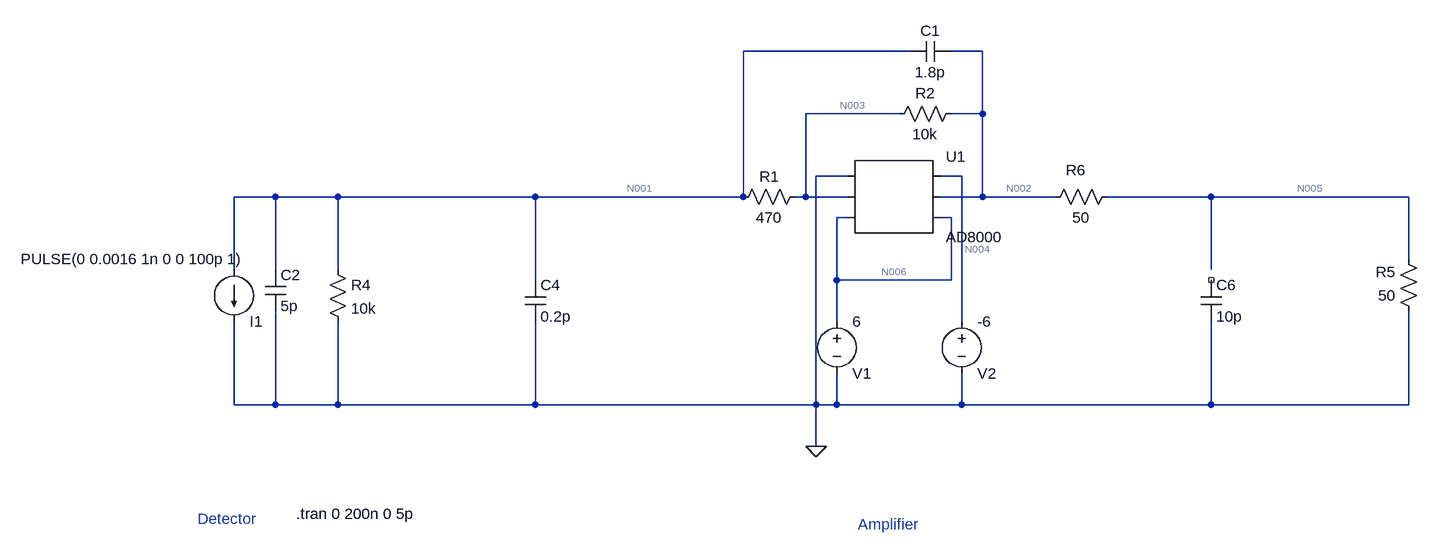
[diagram p0: schematic CFOA-AD8000.asc]
CFOA-AD8000.asc, the LTspice schematic file:
Version 4
SHEET 1 2308 680
WIRE -1488 -2176 -1744 -2176
WIRE -1376 -2176 -1424 -2176
WIRE -1504 -2080 -1648 -2080
WIRE -1376 -2080 -1376 -2176
WIRE -1376 -2080 -1424 -2080
WIRE -1584 -1984 -1632 -1984
WIRE -1408 -1984 -1440 -1984
WIRE -2464 -1952 -2528 -1952
WIRE -2368 -1952 -2464 -1952
WIRE -2064 -1952 -2368 -1952
WIRE -1744 -1952 -1744 -2176
WIRE -1744 -1952 -2064 -1952
WIRE -1648 -1952 -1648 -2080
WIRE -1648 -1952 -1664 -1952
WIRE -1584 -1952 -1648 -1952
WIRE -1376 -1952 -1376 -2080
WIRE -1376 -1952 -1440 -1952
WIRE -1264 -1952 -1376 -1952
WIRE -1024 -1952 -1184 -1952
WIRE -720 -1952 -1024 -1952
WIRE -1584 -1920 -1600 -1920
WIRE -1424 -1920 -1440 -1920
WIRE -720 -1856 -720 -1952
WIRE -2528 -1840 -2528 -1952
WIRE -2464 -1840 -2464 -1952
WIRE -2368 -1840 -2368 -1952
WIRE -1024 -1840 -1024 -1952
WIRE -2064 -1824 -2064 -1952
WIRE -1600 -1824 -1600 -1920
WIRE -1424 -1824 -1424 -1920
WIRE -1424 -1824 -1600 -1824
WIRE -1600 -1760 -1600 -1824
WIRE -1408 -1760 -1408 -1984
WIRE -2528 -1632 -2528 -1760
WIRE -2464 -1632 -2464 -1776
WIRE -2464 -1632 -2528 -1632
WIRE -2368 -1632 -2368 -1760
WIRE -2368 -1632 -2464 -1632
WIRE -2064 -1632 -2064 -1760
WIRE -2064 -1632 -2368 -1632
WIRE -1632 -1632 -1632 -1984
WIRE -1632 -1632 -2064 -1632
WIRE -1600 -1632 -1600 -1680
WIRE -1600 -1632 -1632 -1632
WIRE -1408 -1632 -1408 -1680
WIRE -1408 -1632 -1600 -1632
WIRE -1024 -1632 -1024 -1760
WIRE -1024 -1632 -1408 -1632
WIRE -720 -1632 -720 -1776
WIRE -720 -1632 -1024 -1632
WIRE -1632 -1568 -1632 -1632
FLAG -1632 -1568 0
SYMBOL res -1648 -1968 R90
WINDOW 0 0 56 VBottom 2
WINDOW 3 32 56 VTop 2
SYMATTR InstName R1
SYMATTR Value 470
SYMBOL res -1520 -2064 R270
WINDOW 0 32 56 VTop 2
WINDOW 3 0 56 VBottom 2
SYMATTR InstName R2
SYMATTR Value 10k
SYMBOL cap -1488 -2160 R270
WINDOW 0 32 32 VTop 2
WINDOW 3 0 32 VBottom 2
SYMATTR InstName C1
SYMATTR Value 1.8p
SYMBOL cap -2480 -1840 R0
SYMATTR InstName C2
SYMATTR Value 5p
SYMBOL voltage -1600 -1776 R0
WINDOW 0 24 96 Left 2
WINDOW 3 24 16 Left 2
WINDOW 123 0 0 Left 2
WINDOW 39 0 0 Left 2
SYMATTR InstName V1
SYMATTR Value 6
SYMBOL current -2528 -1840 R0
WINDOW 0 24 80 Left 2
WINDOW 3 -328 -16 Left 2
WINDOW 123 0 0 Left 2
WINDOW 39 0 0 Left 2
SYMATTR InstName I1
SYMATTR Value PULSE(0 0.0016 1n 0 0 100p 1)
SYMBOL voltage -1408 -1776 R0
WINDOW 0 24 96 Left 2
WINDOW 3 24 16 Left 2
WINDOW 123 0 0 Left 2
WINDOW 39 0 0 Left 2
SYMATTR InstName V2
SYMATTR Value -6
SYMBOL res -704 -1760 R180
WINDOW 0 36 76 Left 2
WINDOW 3 36 40 Left 2
SYMATTR InstName R5
SYMATTR Value 50
SYMBOL res -1280 -1936 R270
WINDOW 0 42 48 VTop 2
WINDOW 3 0 56 VBottom 2
SYMATTR InstName R6
SYMATTR Value 50
SYMBOL cap -2080 -1824 R0
SYMATTR InstName C4
SYMATTR Value 0.2p
SYMBOL res -2384 -1856 R0
SYMATTR InstName R4
SYMATTR Value 10k
SYMBOL cap -1040 -1824 R0
SYMATTR InstName C6
SYMATTR Value 10p
SYMBOL AutoGenerated\\AD8000 -1520 -1952 R0
SYMATTR InstName U1
TEXT -2432 -1464 Left 2 !.tran 0 200n 0 5p
TEXT -2584 -1456 Left 2 ;Detector
TEXT -1568 -1448 Left 2 ;Amplifier

The netlist it stands for:
* CFOA-AD8000.asc
R1 N003 N001 470
R2 N003 N002 10k
C1 N001 N002 1.8p
C2 N001 0 5p
V1 N006 0 6
I1 N001 0 PULSE(0 0.0016 1n 0 0 100p 1)
V2 N004 0 -6
R5 0 N005 50
R6 N002 N005 50
C4 N001 0 0.2p
R4 N001 0 10k
C6 NC_01 0 10p
* U1: AD8000 (symbol AutoGenerated\AD8000 not available, pins judged from their places): pin1=0 pin2=N003 pin3=N006 pin4=N004 pin5=N002 pin6=N006
.tran 0 200n 0 5p
* Detector
* Amplifier
.backanno
.end

* Results of the author's LTspice run, read from the files saved beside the schematic
* Operating Point, zero values left out:
*   V(n003) = 990.5 µV
*   V(n001) = 946 µV
*   V(n002) = 50.4 mV
*   V(n006) = 6 V
*   V(n004) = -6 V
*   V(n005) = 25.2 mV
*   I(R4) = 94.6 nA
*   I(R6) = 504 µA
*   I(R5) = -504 µA
*   I(R2) = -4.941 µA
*   I(R1) = 94.6 nA
*   I(V2) = 13.1 mA
*   I(V1) = -14.13 mA
*   Ix(u1:1) = 5.045 µA
*   Ix(u1:2) = 4.846 µA
*   Ix(u1:VCC) = 14.13 mA
*   Ix(u1:VEE) = -13.1 mA
*   Ix(u1:VOUT) = -509 µA
*   Ix(u1:PD) = 600 nA